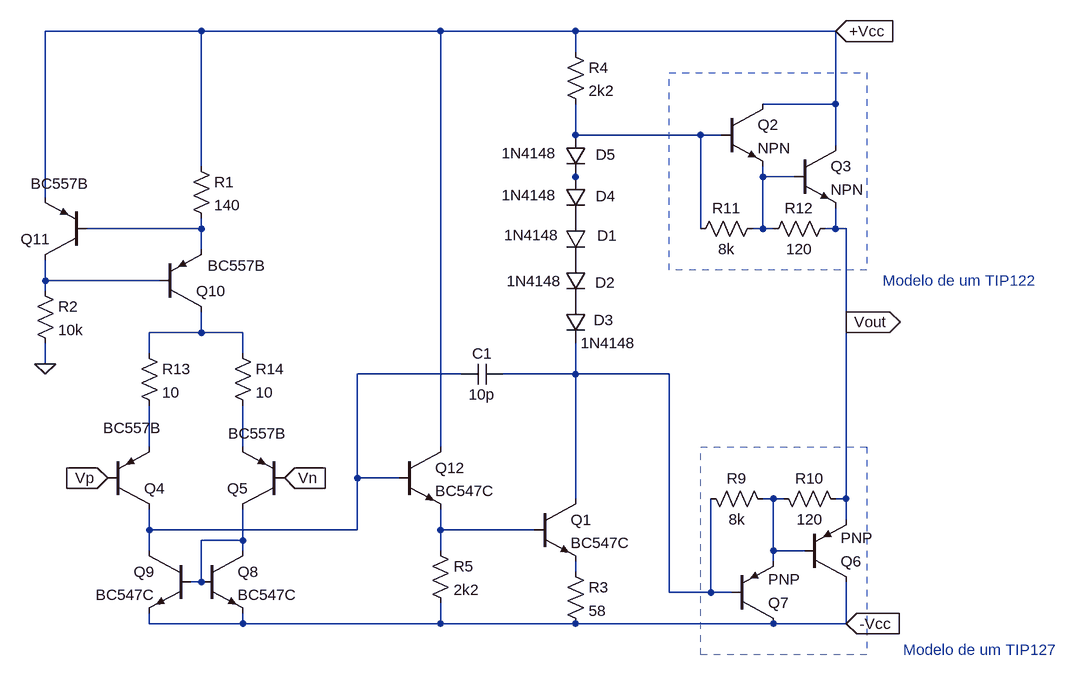
[diagram p0: schematic AudioAmpParCCCE.asc]
AudioAmpParCCCE.asc, the LTspice schematic file:
Version 4
SHEET 1 1444 680
WIRE -64 -528 -304 -528
WIRE 304 -528 -64 -528
WIRE 512 -528 304 -528
WIRE 912 -528 512 -528
WIRE 512 -496 512 -528
WIRE 912 -416 912 -528
WIRE 912 -416 800 -416
WIRE 512 -368 512 -416
WIRE 704 -368 512 -368
WIRE 736 -368 704 -368
WIRE 912 -352 912 -416
WIRE -64 -320 -64 -528
WIRE 512 -304 512 -320
WIRE 800 -304 800 -320
WIRE 848 -304 800 -304
WIRE -304 -272 -304 -528
WIRE -64 -224 -64 -240
WIRE -64 -224 -240 -224
WIRE 704 -224 704 -368
WIRE 800 -224 800 -304
WIRE 800 -224 784 -224
WIRE 816 -224 800 -224
WIRE 912 -224 912 -256
WIRE 912 -224 896 -224
WIRE 928 -224 912 -224
WIRE -64 -192 -64 -224
WIRE -304 -144 -304 -176
WIRE -128 -144 -304 -144
WIRE -304 -128 -304 -144
WIRE 928 -80 928 -224
WIRE -64 -64 -64 -96
WIRE -64 -64 -144 -64
WIRE 0 -64 -64 -64
WIRE -144 -32 -144 -64
WIRE 0 -32 0 -64
WIRE -304 -16 -304 -48
WIRE 336 0 176 0
WIRE 512 0 512 -48
WIRE 512 0 400 0
WIRE 656 0 512 0
WIRE -144 112 -144 48
WIRE 0 112 0 48
WIRE 304 112 304 -528
WIRE 176 160 176 0
WIRE 240 160 176 160
WIRE 512 192 512 0
WIRE 816 192 800 192
WIRE 832 192 816 192
WIRE 928 192 928 -80
WIRE 928 192 912 192
WIRE 928 224 928 192
WIRE -144 240 -144 208
WIRE 176 240 176 160
WIRE 176 240 -144 240
WIRE 304 240 304 208
WIRE 448 240 304 240
WIRE 0 256 0 208
WIRE 0 256 -64 256
WIRE -144 272 -144 240
WIRE 0 272 0 256
WIRE 304 272 304 240
WIRE 816 272 816 192
WIRE 864 272 816 272
WIRE 816 288 816 272
WIRE 512 304 512 288
WIRE -64 320 -64 256
WIRE -64 320 -80 320
WIRE 656 336 656 0
WIRE 720 336 720 192
WIRE 720 336 656 336
WIRE 752 336 720 336
WIRE -144 384 -144 368
WIRE 0 384 0 368
WIRE 0 384 -144 384
WIRE 304 384 304 352
WIRE 304 384 0 384
WIRE 512 384 304 384
WIRE 816 384 512 384
WIRE 928 384 928 320
WIRE 928 384 816 384
FLAG 912 -528 +Vcc
IOPIN 912 -528 In
FLAG 928 384 -Vcc
IOPIN 928 384 In
FLAG 928 -80 Vout
IOPIN 928 -80 Out
FLAG -208 160 Vp
IOPIN -208 160 In
FLAG 64 160 Vn
IOPIN 64 160 In
FLAG -304 -16 0
SYMBOL pnp -208 208 M180
WINDOW 3 -7 125 Left 2
SYMATTR Value BC557B
SYMATTR InstName Q4
SYMBOL pnp 64 208 R180
WINDOW 3 -3 117 Left 2
SYMATTR Value BC557B
SYMATTR InstName Q5
SYMBOL res 704 176 M90
WINDOW 0 0 56 VBottom 2
WINDOW 3 32 56 VTop 2
SYMATTR InstName R9
SYMATTR Value 8k
SYMBOL res 816 176 M90
WINDOW 0 0 56 VBottom 2
WINDOW 3 32 56 VTop 2
SYMATTR InstName R10
SYMATTR Value 120
SYMBOL npn 736 -416 R0
SYMATTR InstName Q2
SYMBOL npn 848 -352 R0
SYMATTR InstName Q3
SYMBOL res 688 -208 R270
WINDOW 0 32 56 VTop 2
WINDOW 3 0 56 VBottom 2
SYMATTR InstName R11
SYMATTR Value 8k
SYMBOL res 800 -208 R270
WINDOW 0 32 56 VTop 2
WINDOW 3 0 56 VBottom 2
SYMATTR InstName R12
SYMATTR Value 120
SYMBOL pnp 864 320 M180
SYMATTR InstName Q6
SYMBOL pnp 752 384 M180
SYMATTR InstName Q7
SYMBOL npn 448 192 R0
SYMATTR InstName Q1
SYMATTR Value BC547C
SYMBOL cap 400 -16 R90
WINDOW 0 0 32 VBottom 2
WINDOW 3 32 32 VTop 2
SYMATTR InstName C1
SYMATTR Value 10p
SYMBOL diode 496 -240 R0
WINDOW 0 49 27 Left 2
WINDOW 3 -94 26 Left 2
SYMATTR InstName D1
SYMATTR Value 1N4148
SYMBOL diode 496 -176 R0
WINDOW 0 46 35 Left 2
WINDOW 3 -90 33 Left 2
SYMATTR InstName D2
SYMATTR Value 1N4148
SYMBOL diode 496 -112 R0
WINDOW 0 44 29 Left 2
SYMATTR InstName D3
SYMATTR Value 1N4148
SYMBOL diode 496 -304 R0
WINDOW 0 47 30 Left 2
WINDOW 3 -98 28 Left 2
SYMATTR InstName D4
SYMATTR Value 1N4148
SYMBOL diode 496 -368 R0
WINDOW 0 47 30 Left 2
WINDOW 3 -98 28 Left 2
SYMATTR InstName D5
SYMATTR Value 1N4148
SYMBOL res -160 -48 R0
SYMATTR InstName R13
SYMATTR Value 10
SYMBOL res -16 -48 R0
SYMATTR InstName R14
SYMATTR Value 10
SYMBOL npn -64 272 R0
SYMATTR InstName Q8
SYMATTR Value BC547C
SYMBOL npn -80 272 M0
SYMATTR InstName Q9
SYMATTR Value BC547C
SYMBOL pnp -128 -96 M180
WINDOW 3 74 71 Left 2
SYMATTR Value BC557B
SYMATTR InstName Q10
SYMBOL pnp -240 -176 R180
WINDOW 3 -3 117 Left 2
SYMATTR Value BC557B
SYMATTR InstName Q11
SYMBOL res -80 -336 R0
SYMATTR InstName R1
SYMATTR Value 140
SYMBOL res -320 -144 R0
SYMATTR InstName R2
SYMATTR Value 10k
SYMBOL res 496 -512 R0
SYMATTR InstName R4
SYMATTR Value 2k2
SYMBOL res 496 288 R0
SYMATTR InstName R3
SYMATTR Value 58
SYMBOL npn 240 112 R0
SYMATTR InstName Q12
SYMATTR Value BC547C
SYMBOL res 288 256 R0
SYMATTR InstName R5
SYMATTR Value 2k2
TEXT 984 -144 Left 2 ;Modelo de um TIP122
TEXT 1016 424 Left 2 ;Modelo de um TIP127
RECTANGLE Normal 960 432 704 112 2
RECTANGLE Normal 960 -160 656 -464 2

The netlist it stands for:
* AudioAmpParCCCE.asc
Q4 N007 Vp N009 0 BC557B
Q5 N013 Vn N010 0 BC557B
R9 N008 N011 8k
R10 N011 Vout 120
Q2 +Vcc N001 N003 0 NPN
Q3 +Vcc N003 Vout 0 NPN
R11 N001 N003 8k
R12 N003 Vout 120
Q6 -Vcc N011 Vout 0 PNP
Q7 -Vcc N008 N011 0 PNP
Q1 N008 N012 N014 0 BC547C
C1 N008 N007 10p
D1 P001 P002 1N4148
D2 P002 P003 1N4148
D3 P003 N008 1N4148
D4 N002 P001 1N4148
D5 N001 N002 1N4148
R13 N006 N009 10
R14 N006 N010 10
Q8 N013 N013 -Vcc 0 BC547C
Q9 N007 N013 -Vcc 0 BC547C
Q10 N006 N005 N004 0 BC557B
Q11 N005 N004 +Vcc 0 BC557B
R1 +Vcc N004 140
R2 N005 0 10k
R4 +Vcc N001 2k2
R3 N014 -Vcc 58
Q12 +Vcc N007 N012 0 BC547C
R5 N012 -Vcc 2k2
.model D D
.lib standard.dio
.model NPN NPN
.model PNP PNP
.lib standard.bjt
* Modelo de um TIP122
* Modelo de um TIP127
.backanno
.end